# EAGLE design alimentation (EAGLE 7.6.0)
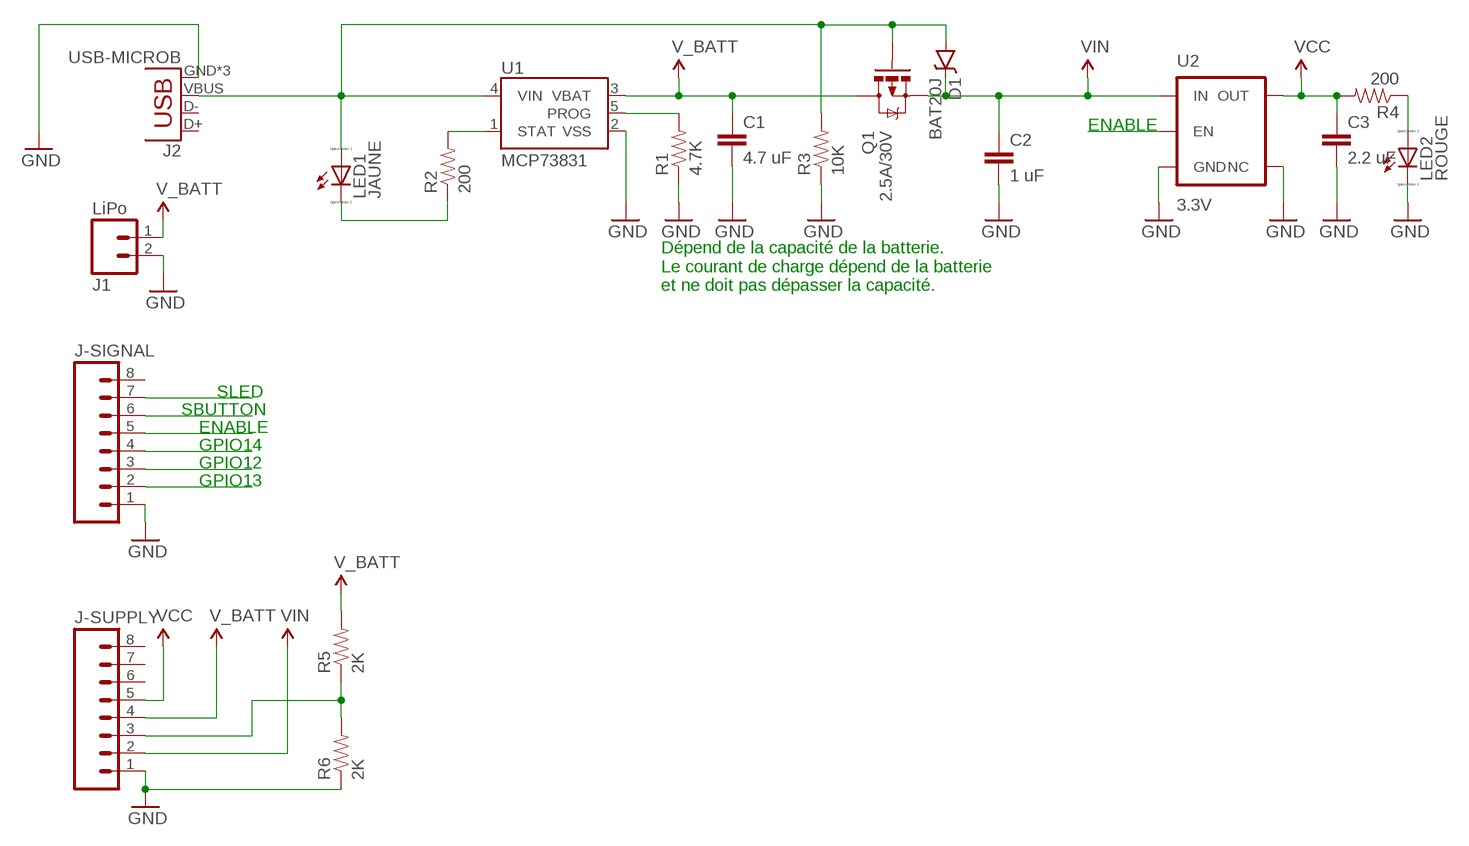
[diagram p0: schematic, sheet 1]

## Parts
C1  4.7 uF  CAP1206  [1206]
C2  1 uF  CAP1206  [1206]
C3  2.2 uF  CAP1206  [1206]
D1  BAT20J  DIODE-SCHOTTKY-BAT20J  [SOD-323]
J1  LiPo  M02JST-PTH-VERT  [JST-2-PTH-VERT]
J2  USB-MICROB  [USB-MICROB]
J-SIGNAL  M08  [1X08_ROUND]
J-SUPPLY  M08  [1X08_ROUND]
LED1  JAUNE  LED_E  [LED_1206]
LED2  ROUGE  LED_E  [LED_1206]
Q1  2.5A/30V  MOSFET-PCHANNELDMG2307L  [SOT23-3]
R1  4.7K  RESISTOR0805-RES  [0805]
R2  200  RESISTOR0805-RES  [0805]
R3  10K  RESISTOR0805-RES  [0805]
R4  200  RESISTOR0805-RES  [0805]
R5  2K  RESISTOR0805-RES  [0805]
R6  2K  RESISTOR0805-RES  [0805]
U1  MCP73831  [SOT23-5]
U2  3.3V  V_REG_AP2112K-3.3V  [SOT23-5]

## Nets
ENABLE: J-SIGNAL.5 U2.3(EN)
GND: C1.2 C2.2 C3.2 J1.2 J2.GND J2.MT1(GND) J2.MT2(GND) J-SIGNAL.1 J-SUPPLY.1 LED2.C R1.1 R3.1 R6.1 U1.2(VSS) U2.2(GND) U2.4(NC)
N$1: LED1.C R2.1
N$2: R1.2 U1.5(PROG)
N$3: LED2.A R4.1
N$4: R2.2 U1.1(STAT)
N$5: J-SIGNAL.2
N$6 [SUPPLY]: J-SUPPLY.3 R5.1 R6.2
N$7: J-SIGNAL.3
N$8: J-SIGNAL.4
N$10: J-SIGNAL.6
N$11: J-SIGNAL.7
V_BATT [SUPPLY]: C1.1 J1.1 J-SUPPLY.4 Q1.3(D) R5.2 U1.3(VBAT)
VCC [SUPPLY]: C3.1 J-SUPPLY.5 R4.2 U2.5(OUT)
VIN [SUPPLY]: C2.1 D1.C J-SUPPLY.2 Q1.2(S) U2.1(IN)
VUSB [SUPPLY]: D1.A J2.VBUS LED1.A Q1.1(G) R3.2 U1.4(VIN)
Unconnected: J2.D+ J2.D- J-SIGNAL.8 J-SUPPLY.6 J-SUPPLY.7 J-SUPPLY.8

## Notes on the sheet
- ENABLE
- Dépend de la capacité de la batterie. 
  Le courant de charge dépend de la batterie 
  et ne doit pas dépasser la capacité.
- SLED
- SBUTTON
- ENABLE
- GPIO14
- GPIO12
- GPIO13

## Library data of the parts
C1-C3 = SparkFun-Capacitors:CAP: Capacitor Standard 0603 ceramic capacitor, and 0.1" leaded capacitor.
D1 = SparkFun-DiscreteSemi:DIODE-SCHOTTKY: Schottky diodes in SFE's production catalog BAT20J 1A 23V 0.62Vf RB751 120mA 40V 0.37Vf PMEG4005EJ 0.5A 40V 0.42Vf MBRA140 1A 40V 0.5Vf B340A 3A 40V SMA; PROD_ID: DIO-11623
J1 = SparkFun-Connectors:M02: Standard 2-pin 0.1" header. Use with - straight break away headers ( PRT-00116) - right angle break away headers (PRT-00553) - swiss pins (PRT-00743) - machine pins (PRT-00117) - female headers (PRT-00115) Molex polarized connector foot print use with: PRT-08233 with associated crimp pins and housings. 2.54_SCREWTERM for use with PRT-10571. 3.5mm Screw Terminal footprints for PRT-08084 5mm Screw Terminal footprints for use with PRT-08432
J2 = SparkFun-Connectors:USB: USB Connectors USB-B-PTH is fully proven SKU : PRT-00139/CONN-08278 USB-miniB is fully proven SKU : PRT-00587 USB-A-PCB is untested. USB-A-H is throughly reviewed, but untested. Spark Fun Electronics SKU : PRT-00437 USB-B-SMT is throughly reviewed, but untested. Needs silkscreen touching up. USB-A-S has not been used/tested USB-MB-H has not been used/tested USB-MICROB has been used. CONN-09505; PROD_ID: CONN-09505
J-SIGNAL J-SUPPLY = SparkFun-Connectors:M08: Header 8 Standard 8-pin 0.1" header. Use with straight break away headers (SKU : PRT-00116), right angle break away headers (PRT-00553), swiss pins (PRT-00743), machine pins (PRT-00117), and female headers (PRT-00115).; PROD_ID: CONN-08437
LED1 LED2 = eagle-ltspice:LED_E: LED Source: http://www.osram.convergy.de Source: www.luxeon.com Source: www.kingbright.com; SPICEMODEL: NONE; SPICEPREFIX: D; SPICETYPE: diode
Q1 = SparkFun-DiscreteSemi:MOSFET-PCHANNEL: Generic PMOSFET IRLML2244 - TRANS-11153 (SOT-23 -20V -4.3A) (1.Gate 2.Source 3.Drain) FQP27P06 - COM-10349 <http://www.sparkfun.com/products/10349> (TO-220 -60V -27A) (1.Gate 2.Source 3.Drain); PROD_ID: TRANS-11308
R1-R6 = SparkFun-Passives:RESISTOR: Resistor Basic schematic elements and footprints for 0603, 1206, and PTH resistors.
U1 = SparkFun-PowerIC:MCP73831: Miniature single cell, fully integrated Li-Ion, Li-polymer charge management controller http://ww1.microchip.com/downloads/en/DeviceDoc/20001984g.pdf IC-09995; PROD_ID: IC-09995
U2 = SparkFun-PowerIC:V_REG_AP2112: AP2112 - 600mA CMOS LDO Regulator w/ Enable The AP2112 is CMOS process low dropout linear regulator with enable function, the regulator delivers a guaranteed 600mA (min.) continuous load current. Features Output Voltage Accuracy: ±1.5% Output Current: 600mA (Min.) Foldback Short Current Protection: 50mA Enable Function to Turn ON/OFF VOUT Low Dropout Voltage (3.3V): 250mV (Typ.) @IOUT=600mA Excellent Load Regulation: 0.2%/A (Typ.) Excellent Line Regulation: 0.02%/V (Typ.) Low Quiescent Current: 55μA (Typ.) Low Standby Current: 0.01μA (Typ.) Low Output Noise: 50μVRMS PSRR: 100Hz -65dB, 1kHz -65dB OTSD Protection Stable with 1.0μF Flexible Cap: Ceramic, Tantalum and Aluminum Electrolytic Operation Temperature Range: -40°C to 85°C ESD: MM 400V, HBM 4000V; PROD_ID: VREG-12457

## Net classes
1 SUPPLY: width 0.5 mm, drill 0.2 mm, clearance 0.5 mm

## Board
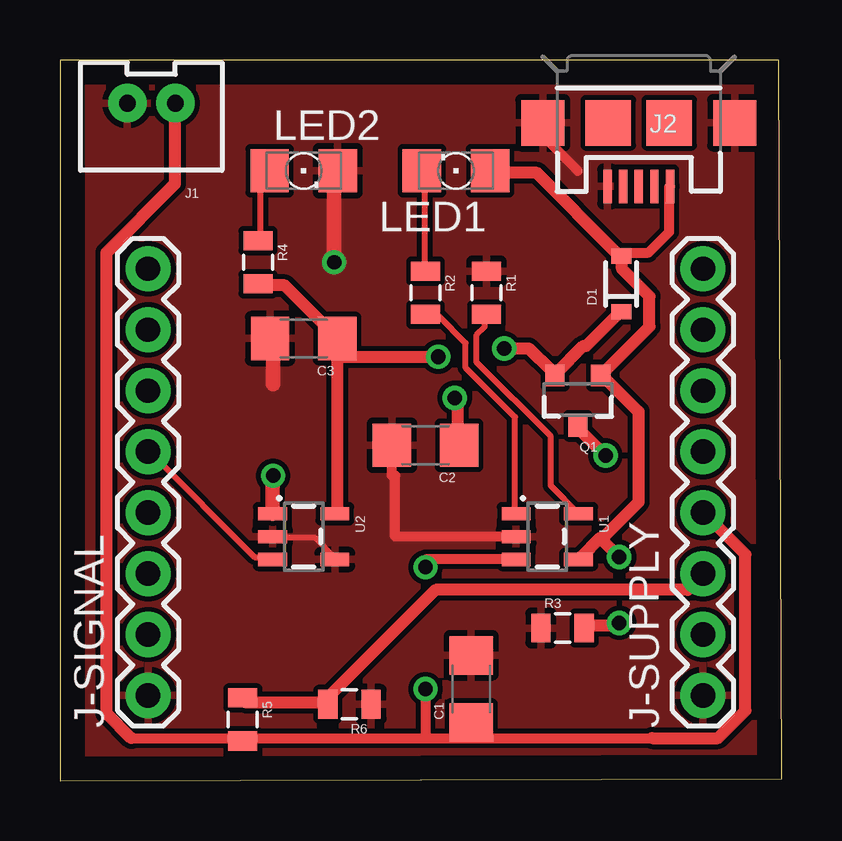
[diagram p1: board, top side]
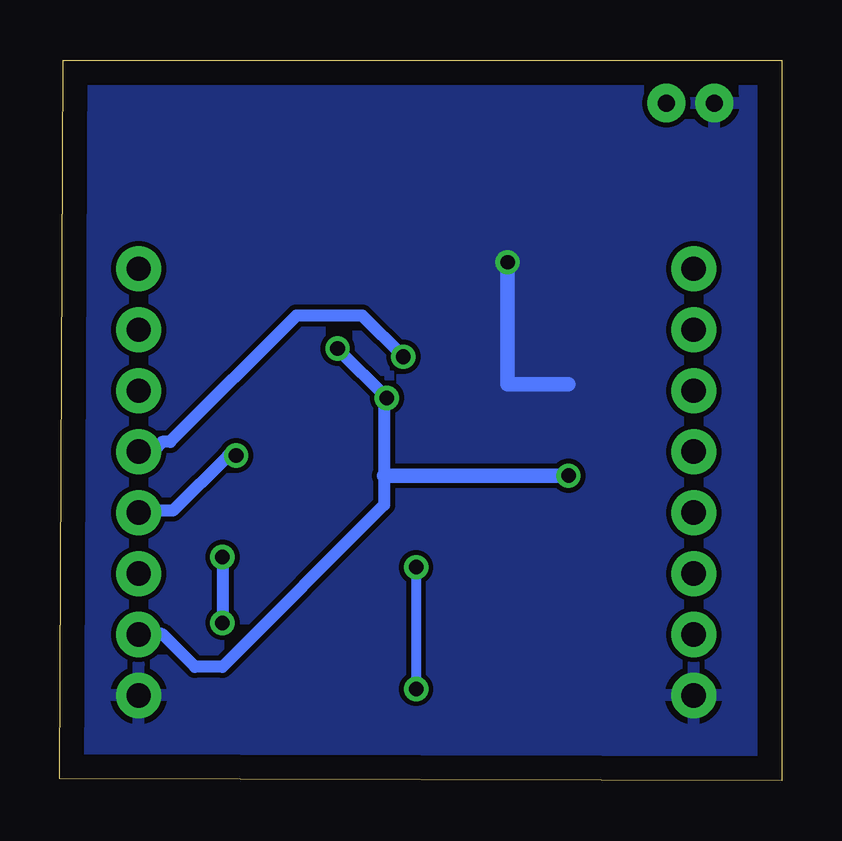
[diagram p2: board, bottom side, seen from below]

Size 30.09 x 30.04 mm. Coordinates in mm from the lower left corner, seen from the top.
Outline: 0,0 30.09,0.1 29.97,30.04 0,30.04 0,0
Copper layers (1*16): Top 0.035mm / dielectric 1.5mm / Bottom 0.035mm
Design rules "default": minimum track width 10mil, minimum drill 24mil, track to track 8mil, track to pad 8mil, pad to pad 8mil, via to via 8mil, smd to smd 8mil, copper to edge 40mil, drill to drill 8mil, minimum pad ring 10mil, minimum via ring 8mil, stop-mask expansion 4mil, vias tented up to drill 0mil, thermal gap 10mil

### Footprints (pad centres in the part's own frame; a part is rotated, then mirrored left to right if it is on the bottom)
1206 = smd 1.6 x 1.8: 1 -1.4,0; 2 1.4,0
SOD-323 = smd 0.63 x 0.83: A 1.15,0; C -1.15,0
JST-2-PTH-VERT = drill 0.7 pad 1.6: 1 -1,-0.55; 2 1,-0.55
USB-MICROB = smd 0.35 x 1.4: D+ 0,2.65; D- -0.65,2.65; GND 1.3,2.65; ID 0.65,2.65; VBUS -1.3,2.65 | smd 1.8 x 1.9: MT1 -4,0; MT2 4,0 | smd 1.9 x 1.9: P$1 -1.27,0; P$2 1.27,0
1X08_ROUND = drill 1.016 pad 1.88: 1 0,0; 2 2.54,0; 3 5.08,0; 4 7.62,0; 5 10.16,0; 6 12.7,0; 7 15.24,0; 8 17.78,0
LED_1206 = smd 1.6 x 1.803: A -1.422,0; C 1.422,0
SOT23-3 = smd 0.8 x 0.9: 1 -0.95,-1; 2 0.95,-1; 3 0,1.1
0805 = smd 0.8 x 1.2: 1 -0.9,0; 2 0.9,0
SOT23-5 = smd 0.55 x 1.2: 1 -0.95,-1.3; 2 0,-1.3; 3 0.95,-1.3; 4 0.95,1.3; 5 -0.95,1.3

### Placement (x,y rotation side)
C1  17.14,3.83 90 top
C2  15.24,13.99 180 top
C3  10.16,18.43 180 top
D1  23.4,20.7 90 top
J1  3.81,27.69 180 top
J2  24.13,27.42 180 top
J-SIGNAL  3.67,3.56 90 top
J-SUPPLY  26.81,3.56 90 top
LED1  16.51,25.42 180 top
LED2  10.16,25.42 0 top
Q1  21.59,15.89 180 top
R1  17.78,20.34 270 top
R2  15.24,20.34 270 top
R3  20.95,6.37 0 top
R4  8.26,21.61 270 top
R5  7.62,2.56 270 top
R6  12.06,3.19 180 top
U1  20.32,10.18 270 top
U2  10.16,10.18 270 top

### Tracks (layer width: path | path; a pad name or v marks a point on that pad's centre or on a via)
ENABLE
  Top 0.254: U2.3 8.8,9.33 8.12,9.33 3.77,13.67 J-SIGNAL.5
GND  (via drill 0.6)
  Top 0.254: 17.72,21.22 R1.1 | 12.92,3.27 R6.1 | U2.2 8.91,10.13 10.63,10.13 11.43,9.33 U2.4
  Top 0.406: U1.2 13.97,10.18 13.97,12.72 13.84,12.72 C2.2 | J2.MT2 20.13,26.88 21.59,25.42 | J2.MT1 28.13,26.88 27.94,26.69
  Top 0.61: C3.2 8.89,18.43 8.89,16.53 | v11.43,21.61 11.43,25.27 LED2.C 11.43,25.42
  Bottom 0.61: 8.89,16.53 11.43,16.53 v11.43,21.61
  pour Top (rank 2): 0,29.95 30,29.95 30,-0.05 0,-0.05
  pour Bottom: 0,29.95 30,29.95 30,-0.05 0,-0.05
N$1
  Top 0.254: R2.1 15.2,21.33 15.2,25.33 LED1.C
N$2
  Top 0.254: R1.2 17.72,19.39 17.72,18.93 17.37,18.59 17.37,17.44 20.46,14.36 20.46,12.3 21.6,11.16 U1.5
N$3
  Top 0.254: R4.1 8.34,22.59 8.34,24.99 8.69,25.33 LED2.A
N$4
  Top 0.254: R2.2 15.32,19.39 15.77,19.39 16.92,18.24 16.92,17.22 18.97,15.16 18.97,11.16 U1.1
N$6
  Top 0.5: R5.1 7.66,3.38 7.77,3.27 11.09,3.27 R6.2 11.2,3.5 15.66,7.96 26.18,7.96 26.75,8.53 J-SUPPLY.3
V_BATT  (via drill 0.6, 0.61)
  Top 0.406: 7.5,1.78 15.24,1.78 | 15.24,1.78 16.51,1.78 | 16.51,1.78 24.69,1.78 | 2.97,1.78 7.5,1.78 | 7.5,1.78 R5.2 | U1.3 15.24,9.23 v15.24,8.91 | v15.24,3.83 15.24,1.78 | C1.1 16.51,2.43 16.51,1.78
  Top 0.5: v22.75,13.56 21.6,14.7 Q1.3 | 2.97,1.78 1.94,2.81 1.94,22.02 4.8,24.87 4.8,28.19 J1.1 | 24.69,1.78 27.43,1.78 28.57,2.93 28.57,9.44 26.86,11.16 J-SUPPLY.4
  Bottom 0.406: v15.24,8.91 v15.24,3.83
  Bottom 0.5: v22.75,13.56 23.09,13.56 25.38,11.27 26.75,11.27 J-SUPPLY.4
VCC  (via drill 0.61)
  Top 0.5: U2.5 11.54,11.16 11.54,18.36 C3.1 | R4.2 8.34,20.64 9.37,20.64 11.43,18.59 C3.1 | v15.77,17.67 11.77,17.67 C3.1
  Bottom 0.5: v15.77,17.67 17.49,19.39 20.23,19.39 25.49,14.13 25.83,14.13 26.18,13.79 26.75,13.79 J-SUPPLY.5
VIN  (via drill 0.6, 0.61)
  Top 0.5: D1.C 23.32,19.5 21.95,18.13 21.83,18.13 20.69,16.99 Q1.2 20.46,17.1 19.55,18.02 v18.52,18.02 | v16.46,15.96 16.57,15.84 16.57,14.01 C2.1
  Top 0.61: U2.1 8.86,12.69 v8.89,12.72
  Bottom 0.5: v18.52,18.02 v16.46,15.96 16.57,15.73 16.57,12.72 16.57,11.5 23.32,4.76 24.46,4.76 25.83,6.13 26.75,6.13 J-SUPPLY.2
  Bottom 0.61: v8.89,12.72 16.57,12.72
VUSB  (via drill 0.61)
  Top 0.406: 23.2,22.02 24.54,22.02 25.4,22.88 25.4,24.74 J2.VBUS
  Top 0.5: 22.63,10.13 22.52,10.13 21.72,9.33 U1.4 | 22.63,10.13 24.12,11.61 24.12,15.39 22.75,16.76 Q1.1 22.63,16.99 24.57,18.93 24.57,20.19 23.43,21.33 23.43,21.79 D1.A 23.2,22.02 19.89,25.33 17.95,25.33 LED1.A | v23.32,6.59 23.2,6.47 21.95,6.47 R3.2 | v23.32,9.33 22.75,9.9 22.63,10.13
  Bottom 0.5: v23.32,9.33 v23.32,6.59